# Altium schematic sheet 1V5 Converter (TLV74215).schdoc
size 124 x 101 mm
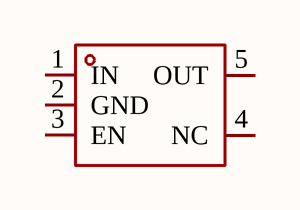
[diagram p0: 1V5 Converter (TLV74215).schdoc]

## Parts
U?  TLV74315PDBVR  [SOT-23-5_L2.9-W1.6-P0.95-LS2.8-BL]  (value not drawn)

## Nets

Not connected (* = marked no-connect by the designer): U? 1(IN) 2(GND) 3(EN) 4(NC) 5(OUT)

## Library data of the parts
U? = TLV74315PDBVR: Manufacturer: TI(德州仪器); Add into BOM: yes; Output Type: Fixed; Maximum Input Voltage: 5.5V; Output Voltage: 1.5V; Output Current: 300mA; Dropout Voltage: 400mV@(300mA); standby current: 60uA; Output Polarity: Positive electrode; Number of Outputs: 1; Symbol: TLV74315PDBVR; Device: TLV74315PDBVR; LCSC Part Name: 具有使能功能的 300mA、低 IQ、低压降稳压器; Supplier Part: C469895; Manufacturer Part: TLV74315PDBVR; Supplier Footprint: SOT-23-5; JLCPCB Part Class: Extended Part; Datasheet: https://www.ti.com/cn/lit/gpn/tlv743p; Supplier: LCSC; Convert to PCB: yes; Feature: 防静电保护；Short-Circuit  Protection；低ESR；Thermal Protection(TSD)；欠压闭锁；Overcurrent Protection(OCP)；带使能; Operating Temperature: -40℃~+125℃@(Tj)